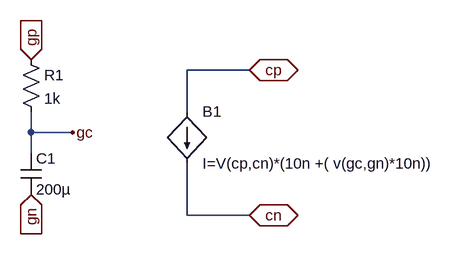
[diagram p0: schematic gasSensor.asc]
gasSensor.asc, the LTspice schematic file:
Version 4
SHEET 1 880 680
WIRE 368 64 272 64
WIRE 272 128 272 64
WIRE 32 160 32 128
WIRE 96 160 32 160
WIRE 32 192 32 160
WIRE 272 288 272 208
WIRE 368 288 272 288
FLAG 32 48 gp
IOPIN 32 48 In
FLAG 32 256 gn
IOPIN 32 256 In
FLAG 96 160 gc
FLAG 368 64 cp
IOPIN 368 64 BiDir
FLAG 368 288 cn
IOPIN 368 288 BiDir
SYMBOL res 16 32 R0
SYMATTR InstName R1
SYMATTR Value 1k
SYMBOL cap 16 192 R0
SYMATTR InstName C1
SYMATTR Value 200µ
SYMBOL bi 272 128 R0
SYMATTR InstName B1
SYMATTR Value I=V(cp,cn)*(10n +( v(gc,gn)*10n))

The netlist it stands for:
* gasSensor.asc
R1 gp gc 1k
C1 gc gn 200µ
B1 cp cn I=V(cp,cn)*(10n +( v(gc,gn)*10n))
.backanno
.end